# EAGLE schematic rev0.1 (EAGLE 8.4.3)
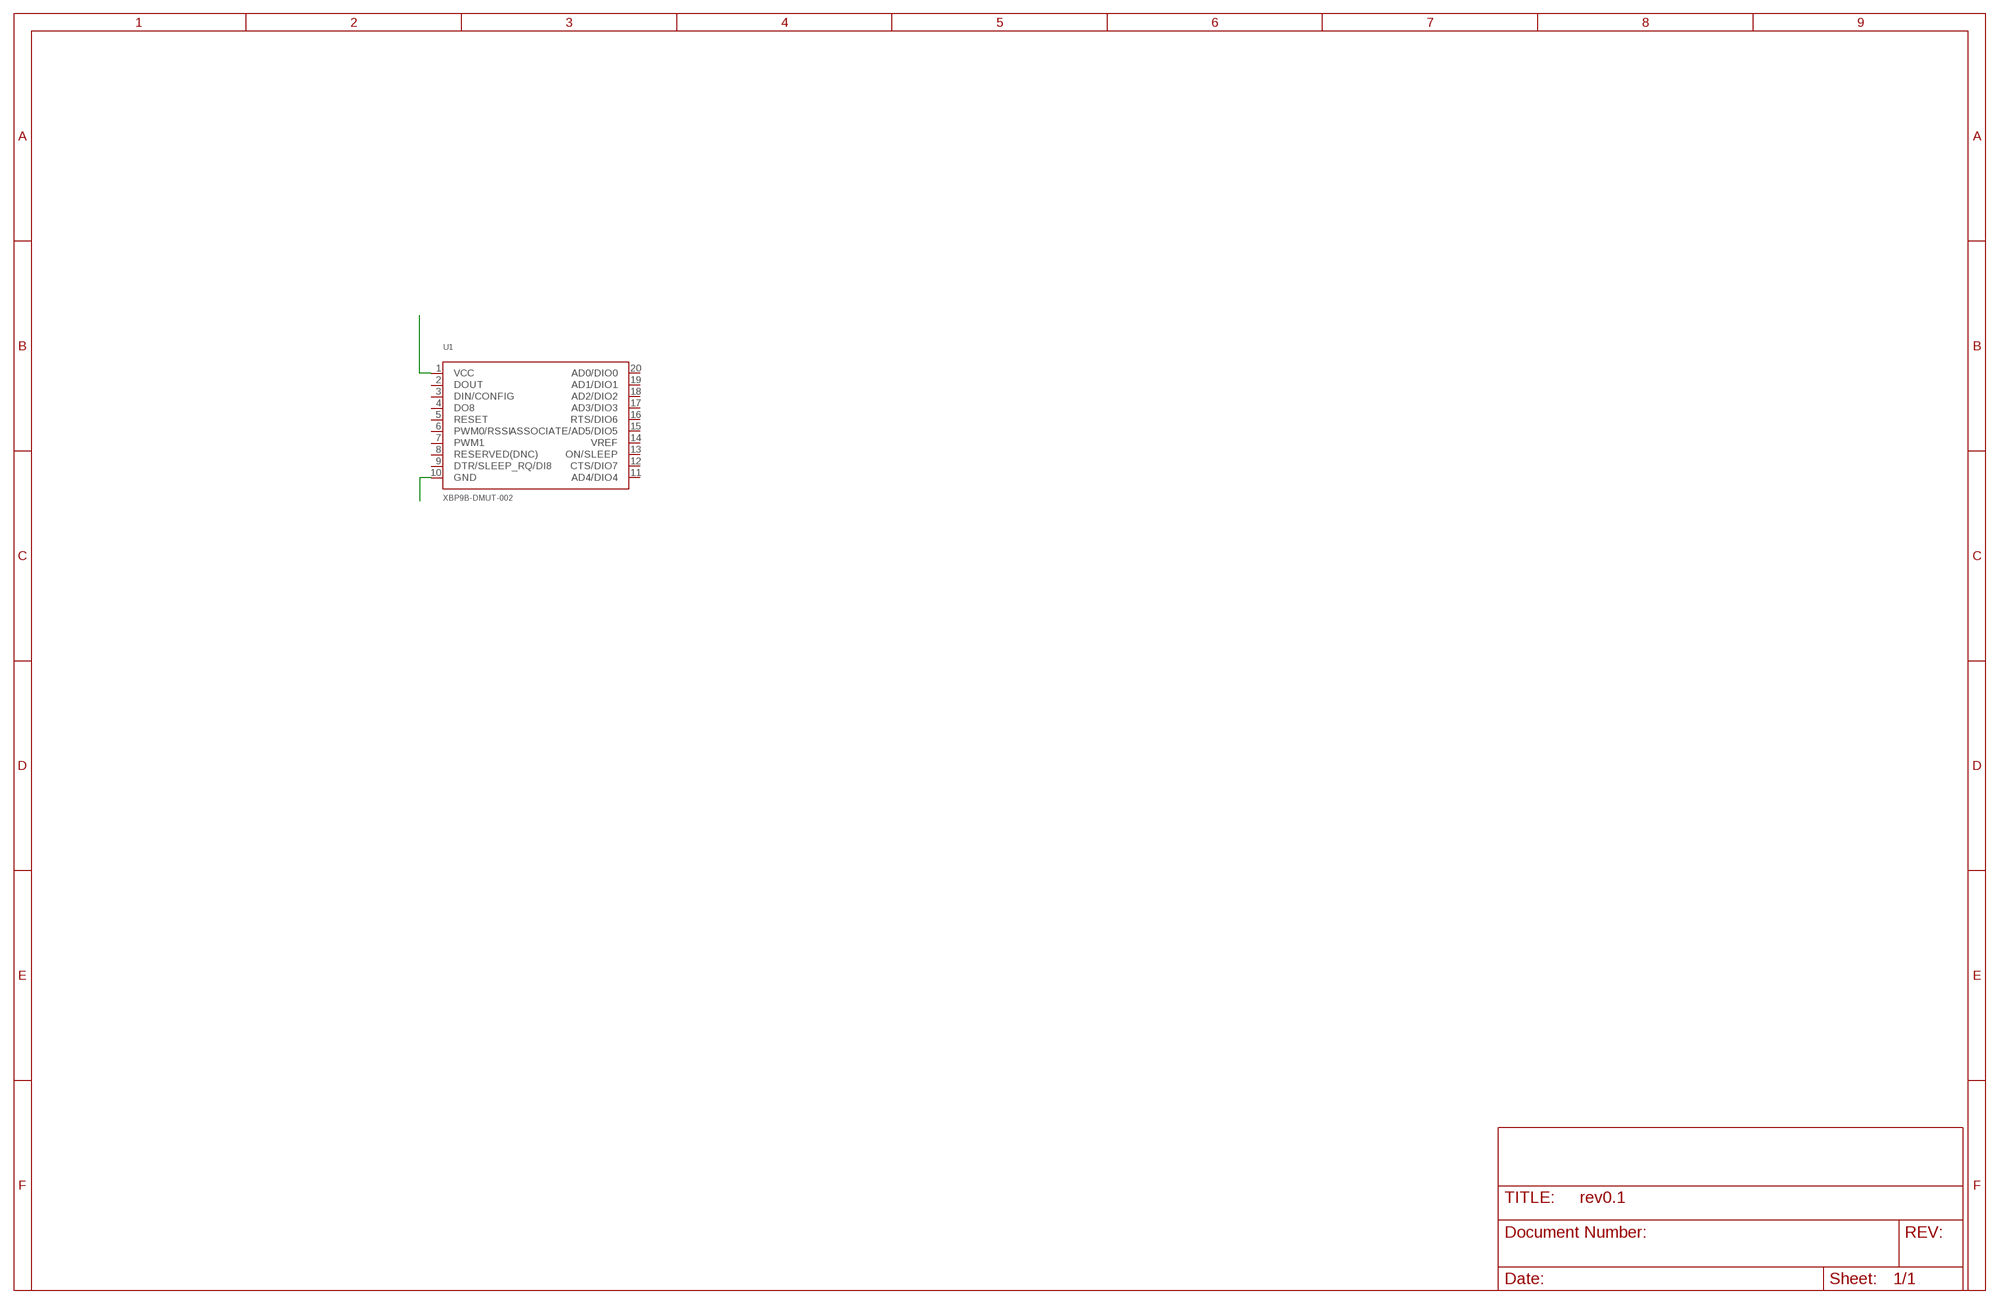
[diagram p0: schematic, sheet 1]

## Parts
U1  XBP9B-DMUT-002  [XBP9B-DMUT-002]

## Nets
N$1: U1.1(VCC)
N$2: U1.10(GND)
Unconnected: U1.2(DOUT) U1.3(DIN/CONFIG) U1.4(DO8) U1.5(RESET) U1.6(PWM0/RSSI) U1.7(PWM1) U1.8(RESERVED(DNC)) U1.9(DTR/SLEEP_RQ/DI8) U1.11(AD4/DIO4) U1.12(CTS/DIO7) U1.13(ON/SLEEP) U1.14(VREF) U1.15(ASSOCIATE/AD5/DIO5) U1.16(RTS/DIO6) U1.17(AD3/DIO3) U1.18(AD2/DIO2) U1.19(AD1/DIO1) U1.20(AD0/DIO0)

## Library data of the parts
U1 = clackboard_lib:XBP9B-DMUT-002